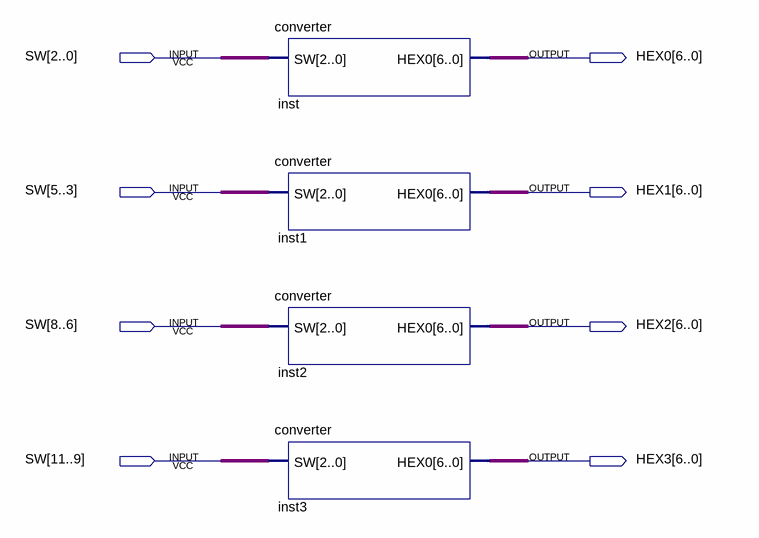
[diagram p0: schematic sheet]
// Quartus schematic converter_ext.bdf as structural Verilog: 4 symbols, 8 pins
module converter_ext (
  input  [11:0] SW,
  output [6:0] HEX0,
  output [6:0] HEX1,
  output [6:0] HEX2,
  output [6:0] HEX3
);

  converter inst (.SW(SW[2:0]), .HEX0(HEX0));
  converter inst1 (.SW(SW[5:3]), .HEX0(HEX1));
  converter inst2 (.SW(SW[8:6]), .HEX0(HEX2));
  converter inst3 (.SW(SW[11:9]), .HEX0(HEX3));
endmodule
